# EAGLE design PortExpanderXRA1207 (EAGLE 7.2.0)
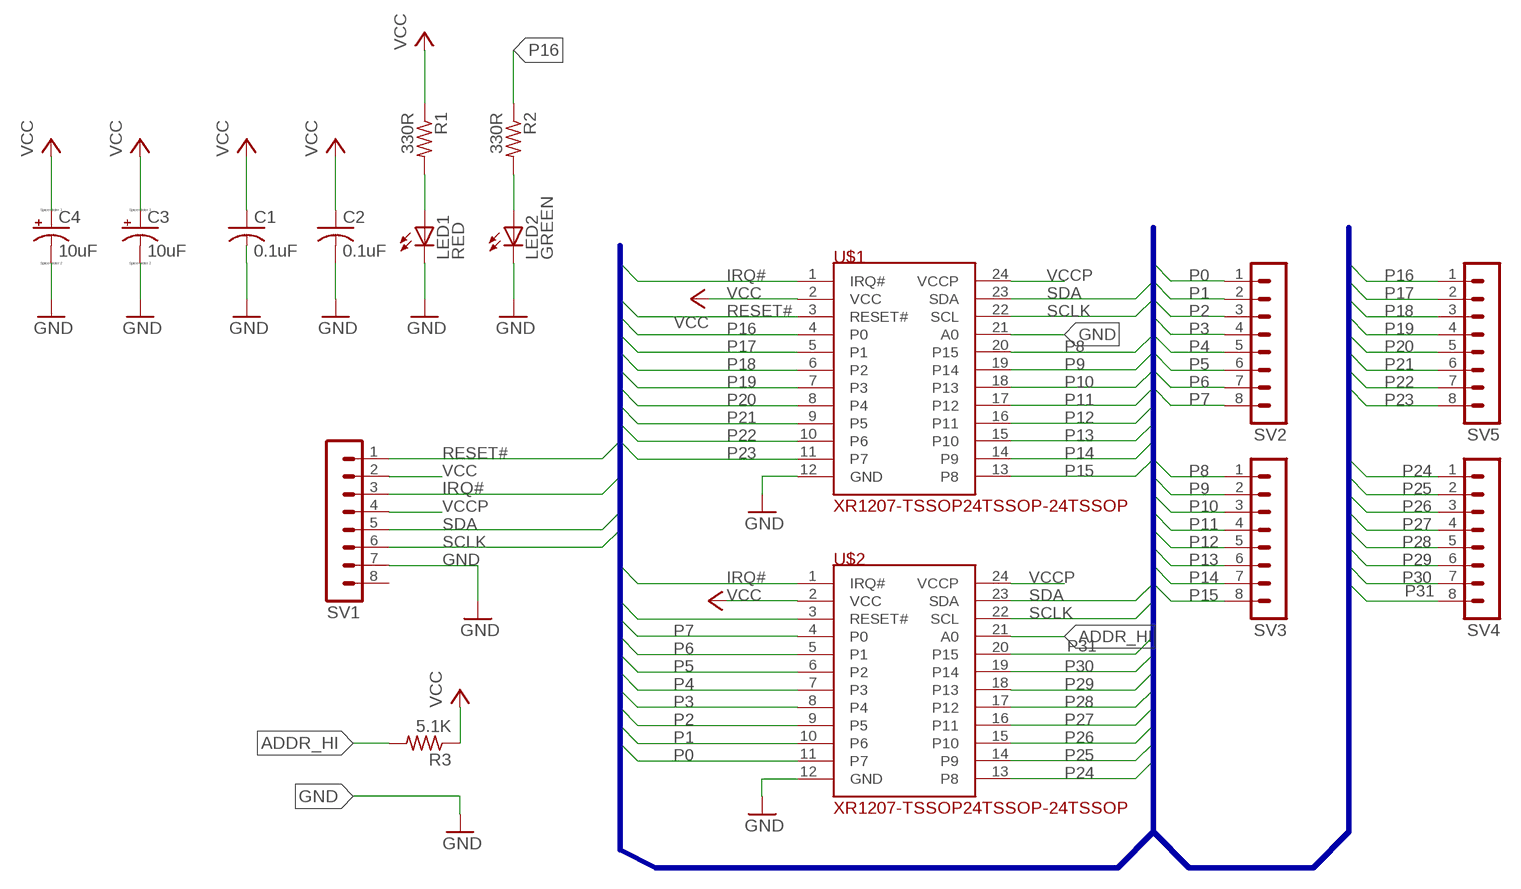
[diagram p0: schematic, sheet 1]

## Parts
C1  0.1uF  C-USC1206  [C1206]
C2  0.1uF  C-USC1206  [C1206]
C3  10uF  CPOL-USE5-5  [E5-5]
C4  10uF  CPOL-USE5-5  [E5-5]
LED1  RED  LEDCHIPLED_0805  [CHIPLED_0805]
LED2  GREEN  LEDCHIPLED_0805  [CHIPLED_0805]
R1  330R  R-US_R1206  [R1206]
R2  330R  R-US_R1206  [R1206]
R3  5.1K  R-US_R1206  [R1206]
SV1  MA08-1  [MA08-1]
SV2  MA08-1  [MA08-1]
SV3  MA08-1  [MA08-1]
SV4  MA08-1  [MA08-1]
SV5  MA08-1  [MA08-1]
U$1  XR1207-TSSOP24TSSOP-24TSSOP  [TSSOP-24]
U$2  XR1207-TSSOP24TSSOP-24TSSOP  [TSSOP-24]

## Nets
ADDR_HI: R3.2 U$2.21(A0)
GND: C1.2 C2.2 C3.- C4.- LED1.C LED2.C SV1.7 U$1.12(GND) U$1.21(A0) U$2.12(GND)
IRQ#: SV1.3 U$1.1(IRQ#) U$2.1(IRQ#)
N$1: LED1.A R1.2
N$2: LED2.A R2.2
P0: SV2.1 U$2.11(P7)
P1: SV2.2 U$2.10(P6)
P2: SV2.3 U$2.9(P5)
P3: SV2.4 U$2.8(P4)
P4: SV2.5 U$2.7(P3)
P5: SV2.6 U$2.6(P2)
P6: SV2.7 U$2.5(P1)
P7: SV2.8 U$2.4(P0)
P8: SV3.1 U$1.20(P15)
P9: SV3.2 U$1.19(P14)
P10: SV3.3 U$1.18(P13)
P11: SV3.4 U$1.17(P12)
P12: SV3.5 U$1.16(P11)
P13: SV3.6 U$1.15(P10)
P14: SV3.7 U$1.14(P9)
P15: SV3.8 U$1.13(P8)
P16: R2.1 SV5.1 U$1.4(P0)
P17: SV5.2 U$1.5(P1)
P18: SV5.3 U$1.6(P2)
P19: SV5.4 U$1.7(P3)
P20: SV5.5 U$1.8(P4)
P21: SV5.6 U$1.9(P5)
P22: SV5.7 U$1.10(P6)
P23: SV5.8 U$1.11(P7)
P24: SV4.1 U$2.13(P8)
P25: SV4.2 U$2.14(P9)
P26: SV4.3 U$2.15(P10)
P27: SV4.4 U$2.16(P11)
P28: SV4.5 U$2.17(P12)
P29: SV4.6 U$2.18(P13)
P30: SV4.7 U$2.19(P14)
P31: SV4.8 U$2.20(P15)
RESET#: SV1.1 U$1.3(RESET#) U$2.3(RESET#)
SCLK: SV1.6 U$1.22(SCL) U$2.22(SCL)
SDA: SV1.5 U$1.23(SDA) U$2.23(SDA)
VCC: C1.1 C2.1 C3.+ C4.+ R1.1 R3.1 SV1.2 U$1.2(VCC) U$2.2(VCC)
VCCP: SV1.4 U$1.24(VCCP) U$2.24(VCCP)
Unconnected: SV1.8

## Buses
P[0..32],SDA,SCLK,IRQ#,RESET#

## Library data of the parts
C1 C2 = resistor:C-US: CAPACITOR, American symbol
C3 C4 = resistor:CPOL-US: POLARIZED CAPACITOR, American symbol
LED1 LED2 = led:LED: LED OSRAM: - CHIPLED LG R971, LG N971, LY N971, LG Q971, LY Q971, LO R971, LY R971 LH N974, LH R974 LS Q976, LO Q976, LY Q976 LO Q996 - Hyper CHIPLED LW Q18S LB Q993, LB Q99A, LB R99A - SideLED LS A670, LO A670, LY A670, LG A670, LP A670 LB A673, LV A673, LT A673, LW A673 LH A674 LY A675 LS A676, LA A676, LO A676, LY A676, LW A676 LS A679, LY A679, LG A679 - Hyper Micro SIDELED® LS Y876, LA Y876, LO Y876, LY Y876 LT Y87S - SmartLED LW L88C, LW L88S LB L89C, LB L89S, LG L890 LS L89K, LO L89K, LY L89K LS L896, LA L896, LO L896, LY L896 - TOPLED LS T670, LO T670, LY T670, LG T670, LP T670 LSG T670, LSP T670, LSY T670, LOP T670, LYG T670 LG T671, LOG T671, LSG T671 LB T673, LV T673, LT T673, LW T673 LH T674 LS T676, LA T676, LO T676, LY T676, LB T676, LH T676, LSB T676, LW T676 LB T67C, LV T67C, LT T67C, LS T67K, LO T67K, LY T67K, LW E67C LS E67B, LA E67B, LO E67B, LY E67B, LB E67C, LV E67C, LT E67C LW T67C LS T679, LY T679, LG T679 LS T770, LO T770, LY T770, LG T770, LP T770 LB T773, LV T773, LT T773, LW T773 LH T774 LS E675, LA E675, LY E675, LS T675 LS T776, LA T776, LO T776, LY T776, LB T776 LHGB T686 LT T68C, LB T68C - Hyper Mini TOPLED® LB M676 - Mini TOPLED Santana® LG M470 LS M47K, LO M47K, LY M47K Source: http://www.osram.convergy.de LUXEON: - LUMILED® LXK2-PW12-R00, LXK2-PW12-S00, LXK2-PW14-U00, LXK2-PW14-V00 LXK2-PM12-R00, LXK2-PM12-S00, LXK2-PM14-U00 LXK2-PE12-Q00, LXK2-PE12-R00, LXK2-PE12-S00, LXK2-PE14-T00, LXK2-PE14-U00 LXK2-PB12-K00, LXK2-PB12-L00, LXK2-PB12-M00, LXK2-PB14-N00, LXK2-PB14-P00, LXK2-PB14-Q00 LXK2-PR12-L00, LXK2-PR12-M00, LXK2-PR14-Q00, LXK2-PR14-R00 LXK2-PD12-Q00, LXK2-PD12-R00, LXK2-PD12-S00 LXK2-PH12-R00, LXK2-PH12-S00 LXK2-PL12-P00, LXK2-PL12-Q00, LXK2-PL12-R00 Source: www.luxeon.com KINGBRIGHT: KA-3528ASYC Source: www.kingbright.com
R1-R3 = resistor:R-US_: RESISTOR, American symbol
SV1-SV5 = con-lstb:MA08-1: PIN HEADER; OC_FARNELL: unknown; OC_NEWARK: unknown
U$1 U$2 = ExarLib:XR1207-TSSOP24

## Board
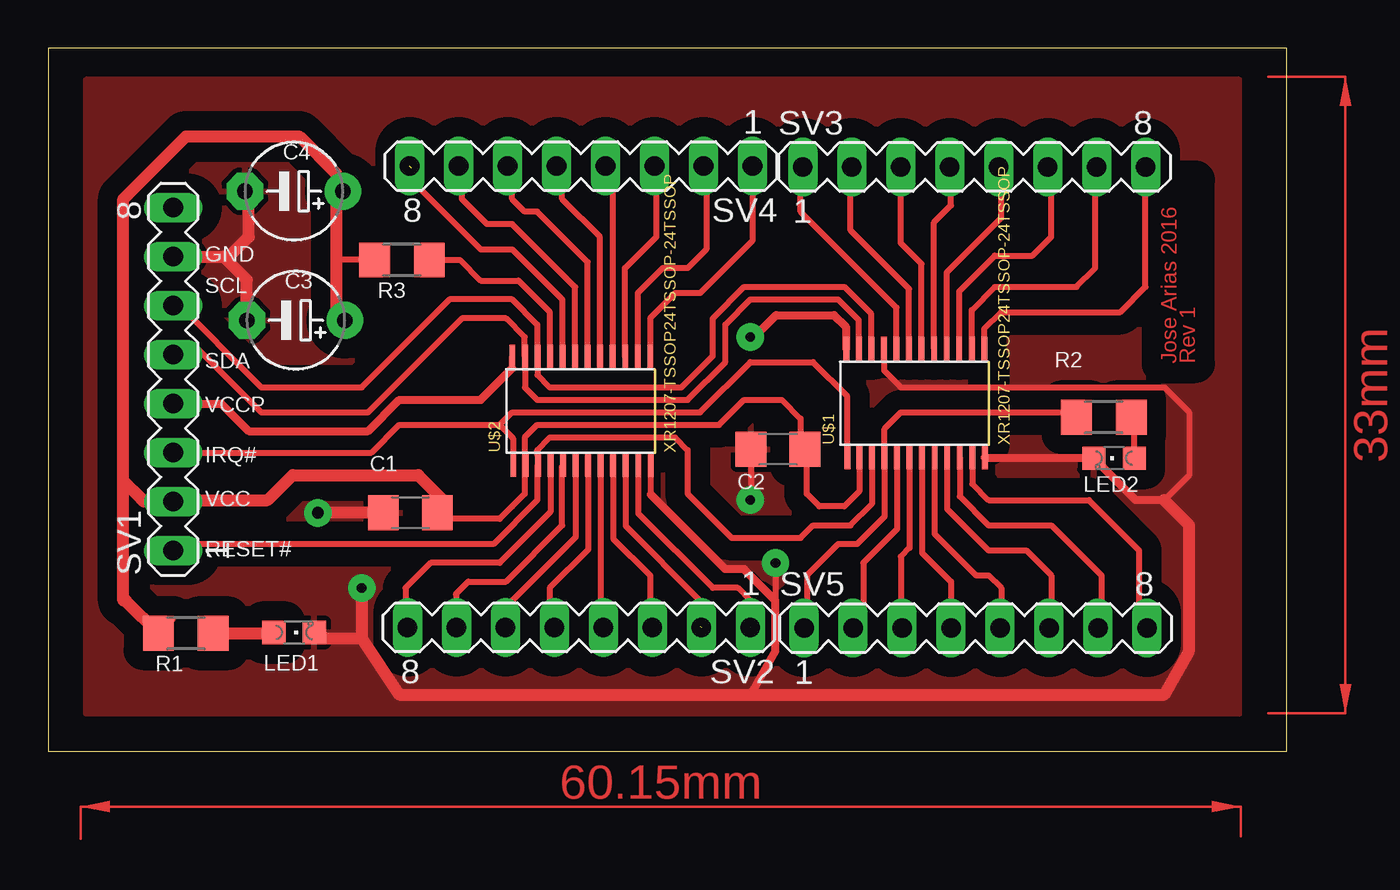
[diagram p1: board, top side]
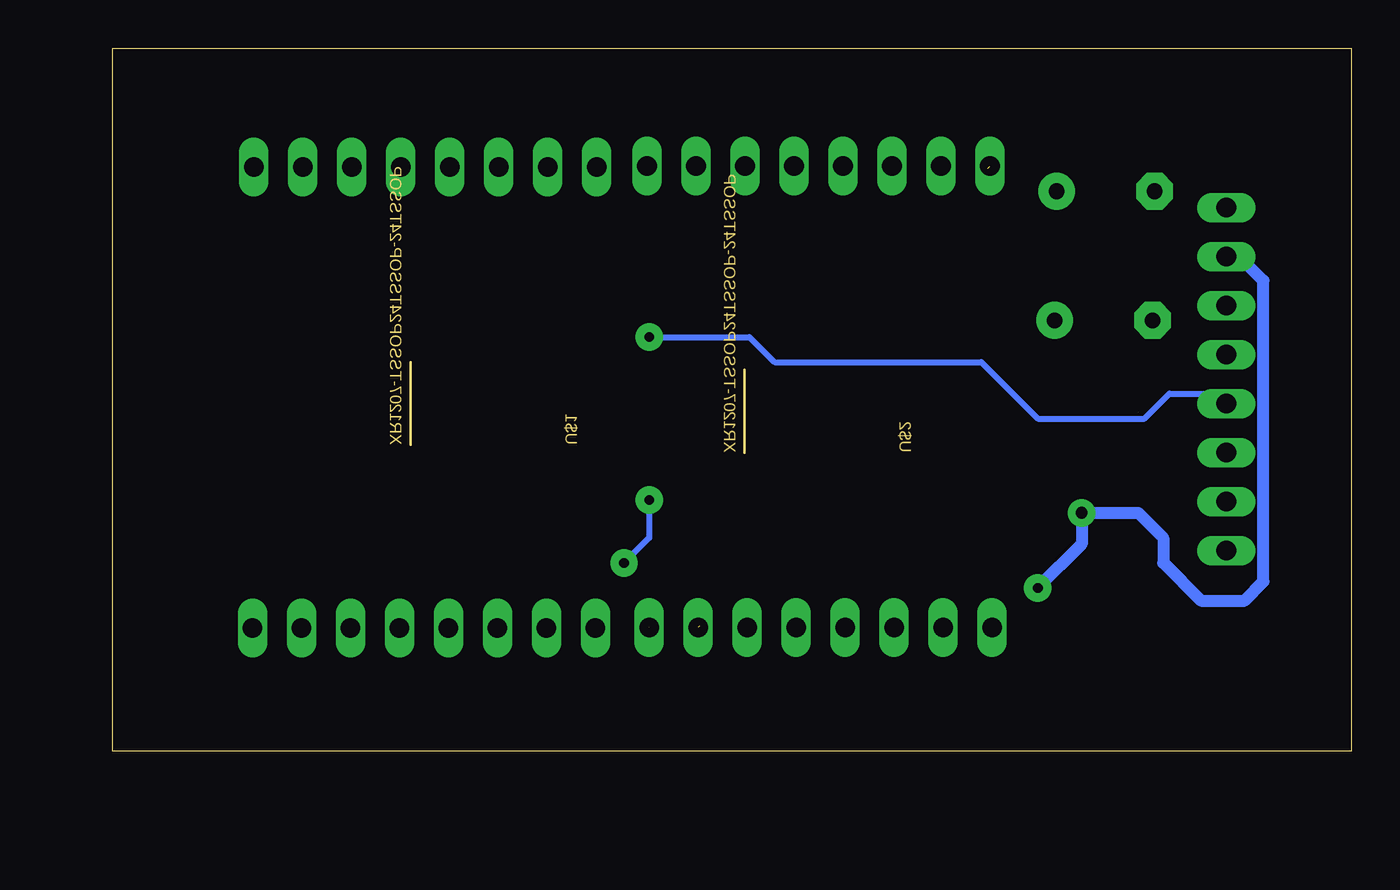
[diagram p2: board, bottom side, seen from below]

Size 64.24 x 36.43 mm. Coordinates in mm from the lower left corner, seen from the top.
Outline: 0,0 64.24,0 64.24,36.43 0,36.43 0,0
Copper layers (1*16): Top 0.035mm / dielectric 1.5mm / Bottom 0.035mm
Design rules "default": minimum track width 10mil, minimum drill 24mil, track to track 8mil, track to pad 8mil, pad to pad 8mil, via to via 8mil, smd to smd 8mil, copper to edge 40mil, drill to drill 8mil, minimum pad ring 10mil, minimum via ring 8mil, stop-mask expansion 4mil, vias tented up to drill 0mil, thermal gap 10mil

### Footprints (pad centres in the part's own frame; a part is rotated, then mirrored left to right if it is on the bottom)
C1206 = smd 1.6 x 1.8: 1 -1.4,0; 2 1.4,0
E5-5 = drill 0.813 pad 1.905: + -2.54,0 | drill 0.813 pad 1.905 octagon: - 2.54,0
CHIPLED_0805 = smd 1.2 x 1.2: A 0,-1.05; C 0,1.05
R1206 = smd 1.6 x 1.803: 1 -1.422,0; 2 1.422,0
MA08-1 = drill 1.016 long: 1 -8.89,0; 2 -6.35,0; 3 -3.81,0; 4 -1.27,0; 5 1.27,0; 6 3.81,0; 7 6.35,0; 8 8.89,0
TSSOP-24 = smd 1.206 x 0.305: 1 -0.65,-0.351; 2 -0.65,-0.975; 3 -0.65,-1.626; 4 -0.65,-2.276; 5 -0.65,-2.926; 6 -0.65,-3.576; 7 -0.65,-4.227; 8 -0.65,-4.877; 9 -0.65,-5.527; 10 -0.65,-6.177; 11 -0.65,-6.828; 12 -0.65,-7.478; 13 4.999,-7.452; 14 4.999,-6.802; 15 4.999,-6.152; 16 4.999,-5.502; 17 4.999,-4.851; 18 4.999,-4.201; 19 4.999,-3.551; 20 4.999,-2.901; 21 4.999,-2.25; 22 4.999,-1.6; 23 4.999,-0.95; 24 4.999,-0.3

### Placement (x,y rotation side)
C1  18.78,12.35 180 top
C2  37.84,15.64 180 top
C3  12.84,22.33 180 top
C4  12.74,29.02 180 top
LED1  12.75,6.15 270 top
LED2  55.27,15.19 90 top
R1  7.14,6.11 0 top
R2  54.74,17.31 0 top
R3  18.34,25.46 0 top
SV1  6.48,19.28 90 top
SV2  27.52,6.41 180 top
SV3  48.02,30.28 0 top
SV4  27.63,30.33 180 top
SV5  48.09,6.38 0 top
U$1  41.09,15.87 90 top
U$2  23.77,15.47 90 top

### Tracks (layer width: path | path; a pad name or v marks a point on that pad's centre or on a via)
ADDR_HI
  Top 0.305: U$2.21 26.02,22.75 24.38,24.38 22.43,24.38 21.36,25.46 R3.2 19.83,24.95 | 19.86,24.71 19.83,24.95 | 19.92,25.03 19.83,24.95
GND  (via drill 0.5 pad 1.42, 0.6)
  Top 0.305: 54.19,15.22 LED2.C | U$1.21 43.34,19.73 44.22,18.86 57.87,18.86 59.17,17.56 59.17,14.31 57.87,13 | 57.87,13 | 9.1,25.63 9.37,25.63 | 14.3,5.85 LED1.C | 31.25,13.29 U$2.12 | v13.99,12.35 v13.98,12.35 | C2.2 36.44,13.03 v36.41,13 | v37.71,9.75 37.71,7.48 | 16.26,5.85
  Top 0.406: U$1.12 54.19,15.22 | 57.87,13 56.4,13 LED2.C | 36.41,2.93 37.71,5.2 37.71,7.48 37.71,7.8 36.09,9.43 35.11,9.43 31.25,13.29
  Top 0.61: SV1.7 9.1,25.63 10.3,24.43 C3.- 10.3,23.63 | 9.37,25.63 10.4,26.66 10.4,28.81 C4.- | 16.26,5.85 18.21,2.93 36.41,2.93 57.87,2.93 59.17,5.2 59.17,11.7 57.87,13 | 14.3,5.85 16.26,5.85 | C1.2 v13.99,12.35 | v16.26,8.45 16.26,5.85
  Bottom 0.305: v36.41,13 36.41,11.05 v37.71,9.75
  Bottom 0.61: v13.98,12.35 13.98,10.73 v16.26,8.45 | v13.99,12.35 11.05,12.35 9.75,11.05 9.75,9.75 7.8,7.8 5.53,7.8 4.55,8.78 4.55,24.38 5.85,25.68 6.42,25.68 SV1.7
  pour Top (isolate 1.016): 1.95,34.79 1.95,1.95 61.77,1.95 61.77,34.79
IRQ#
  Top 0.305: 23.41,16.91 18.21,16.91 16.77,15.47 SV1.3 | 23.41,16.91 24.06,16.26 arc-45 24.12,16.1 U$2.1 | U$1.1 41.44,18.38 39.66,20.16 36.41,20.16 33.81,17.56 24.06,17.56 23.41,16.91
N$1
  Top 0.305: 11.66,6.11 LED1.A
  Top 0.61: R1.2 11.66,6.11
N$2
  Top 0.305: LED2.A 56.32,17.15 R2.2
P0  (1 unrouted)
  Top 0.305: U$2.11 30.6,12.32 34.46,8.45 35.76,8.45 36.41,7.8 SV2.1
P1  (1 unrouted)
  Top 0.305: U$2.10 29.95,11.67 33.81,7.8 33.81,6.47
P2
  Top 0.305: U$2.9 29.3,11.02 31.21,9.1 31.21,6.53 SV2.3
P3
  Top 0.305: U$2.8 28.65,6.55 SV2.4
P4
  Top 0.305: U$2.7 28,10.44 26.01,8.45 26.01,6.65 SV2.5
P5
  Top 0.305: U$2.6 27.35,11.09 24.06,7.8 24.06,6.75 SV2.6
P6
  Top 0.305: SV2.7 21.17,8.09 21.13,8.13 21.78,8.78 23.73,8.78 26.66,11.7 26.66,14.78 U$2.5
P7
  Top 0.305: U$2.4 26.05,12.39 23.41,9.75 19.83,9.75 18.53,8.45 18.53,6.51 SV2.8
P8
  Top 0.305: U$1.20 43.99,22.98 39.01,27.96 39.01,30.16 SV3.1
P9
  Top 0.305: U$1.19 44.64,23.96 41.62,26.98 41.62,30.22 SV3.2
P10
  Top 0.305: SV3.3 44.22,26.33 45.29,25.26 U$1.18
P11
  Top 0.305: U$1.17 45.94,27.41 46.82,28.29 46.82,30.21 SV3.4
P12
  Top 0.305: SV3.5 49.42,30.15 49.42,27.63 46.59,24.81 U$1.16
P13
  Top 0.305: U$1.15 47.24,23.83 49.09,25.68 51.04,25.68 52.02,26.66 52.02,30.09 SV3.6
P14
  Top 0.305: SV3.7 54.29,30.2 54.29,25.03 53.32,24.06 49.09,24.06 47.89,22.86 U$1.14
P15
  Top 0.305: SV3.8 56.9,30.26 56.9,24.06 55.6,22.76 49.42,22.76 48.54,21.88 U$1.13
P16
  Top 0.305: R2.1 53.07,17.56 44.22,17.56 43.37,16.71 U$1.4 43.37,12.16 41.94,10.73 40.96,10.73 39.34,9.1 39.34,6.52 SV5.1
P17
  Top 0.305: U$1.5 44.02,11.51 42.27,9.75 42.27,6.9 SV5.2
P18
  Top 0.305: SV5.3 44.22,6.44 44.22,10.08 44.67,10.53 U$1.6
P19
  Top 0.305: U$1.7 45.32,10.28 46.82,8.78 SV5.4
P20
  Top 0.305: U$1.8 45.97,11.25 48.12,9.1 48.77,9.1 49.42,8.45 49.42,6.43 SV5.5
P21
  Top 0.305: U$1.9 46.62,12.55 48.77,10.4 50.72,10.4 52.02,9.1 52.02,6.49 SV5.6
P22
  Top 0.305: U$1.10 47.27,13.2 48.77,11.7 52.02,11.7 54.62,9.1 54.62,6.56 SV5.7
P23
  Top 0.305: U$1.11 47.92,13.85 48.77,13 53.97,13 56.57,10.4 56.57,6.79 SV5.8
P24
  Top 0.305: SV4.1 36.52,26.44 33.81,23.73 32.51,23.73 31.21,22.43 31.21,20.48 U$2.13
P25
  Top 0.305: SV4.2 34.14,30.17 34.14,26.01 33.16,25.03 31.86,25.03 30.56,23.73 30.56,20.48 U$2.14
P26
  Top 0.305: U$2.15 29.91,20.48 29.91,25.03 31.54,26.66 31.54,30.23 SV4.3
P27
  Top 0.305: U$2.16 29.26,20.48 29.26,29.84 arc45 29.17,30.06 SV4.4
P28
  Top 0.305: 26.36,30.21 SV4.5 26.66,30.03 26.66,28.61 28.61,26.66 28.61,20.48 U$2.17
P29
  Top 0.305: U$2.18 27.97,25.35 25.36,27.96 24.71,27.96 24.06,28.61 24.06,30.09 SV4.6
P30
  Top 0.305: U$2.19 27.32,24.05 24.06,27.31 22.76,27.31 21.46,28.61 21.46,30.15 SV4.7
P31  (1 unrouted)
  Top 0.305: U$2.20 26.67,23.4 24.06,26.01 22.43,26.01 18.86,29.59 18.86,30.21
RESET#
  Top 0.305: U$1.3 42.72,12.81 41.62,11.7 39.66,11.7 39.01,11.05 35.44,11.05 33.16,13.33 33.16,15.61 32.51,16.26 26.01,16.26 25.36,15.61 25.36,15.43 U$2.3 25.36,14.78 25.36,13 23.08,10.73 6.82,10.73 SV1.1
SCLK
  Top 0.305: U$1.22 42.69,22.66 41.29,24.06 36.09,24.06 34.46,22.43 34.46,20.48 32.84,18.86 26.01,18.86 25.37,19.49 U$2.22 25.36,20.48 25.36,22.11 24.06,23.41 20.81,23.41 16.26,18.86 11.05,18.86 6.5,23.41 SV1.6
SDA  (1 unrouted)
  Top 0.305: U$1.23 42.04,22.33 40.96,23.41 36.41,23.41 35.11,22.11 35.11,20.16 33.16,18.21 25.36,18.21 24.72,18.84 U$2.23 24.71,20.48 24.71,21.46 23.73,22.43 21.46,22.43 16.58,17.56 11.05,17.56 7.8,20.81 6.5,20.81 SV1.5
VCC
  Top 0.305: 6.48,6.87 R1.1 | 15.05,24.81 14.96,24.71 | 5.93,12.93 SV1.2 6.56,13 | 24.71,14.85 24.71,16.26 25.36,16.91 34.79,16.91 36.09,18.21 38.04,18.21 39.01,17.23 39.01,16.06 C2.1 39.34,15.55 39.34,13.33 39.99,12.68 41.29,12.68 42.07,13.46 U$1.2 | 24.71,14.85 U$2.2 | 24.71,14.85 24.71,13.33 24.06,12.68 | 15.05,24.16 14.96,24.06 | R3.1 15.05,25.46 | 24.06,12.68 | 24.06,12.68 23.41,12.03 20.5,12.03 C1.1
  Top 0.406: 14.96,28.69 C4.+ | 15.05,25.46 14.96,25.36
  Top 0.61: C3.+ 14.96,22.76 14.96,24.06 14.96,24.71 14.96,25.36 14.96,28.69 | 3.9,13.98 3.9,7.8 4.02,7.8 R1.1 | 3.9,13.98 3.9,28.61 7.15,31.86 13,31.86 14.96,29.91 14.96,29.34 C4.+ | 5.93,12.93 5.08,12.93 arc-45 4.86,13.02 3.9,13.98 | C1.1 20.48,12.65 20.48,13 19.18,14.31 12.68,14.31 11.38,13 6.56,13
VCCP  (via drill 0.5 pad 1.42)
  Top 0.305: v36.41,21.46 36.61,21.46 | 24.06,19.83 24.06,20.44 arc-45 U$2.24
  Top 0.406: 36.61,21.46 37.75,22.6 40.75,22.6 41.39,21.96 U$1.24 | SV1.4 8.98,18.01 10.4,16.58 16.58,16.58 18.21,18.21 22.43,18.21 24.06,19.83
  Bottom 0.305: v36.41,21.46 31.21,21.46 29.91,20.16 19.18,20.16 16.26,17.23 10.73,17.23 9.43,18.53 7.01,18.53 SV1.4
(copper drawn outside any net)
  shapes: Top area x2

### Text on the board
Top: Jose Arias 2016 / Rev 1
tNames: GND | SCL | SDA | VCCP | IRQ# | VCC | RESET#